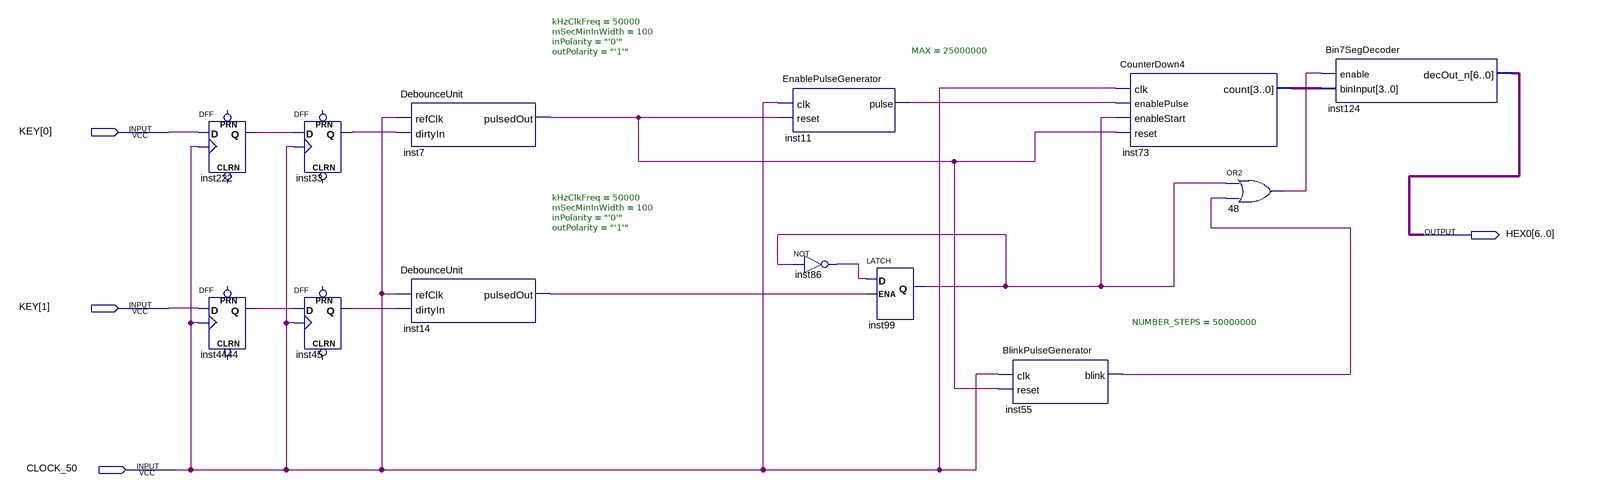
[diagram p0: schematic sheet]
// Quartus schematic Fase6.bdf as structural Verilog: 13 symbols, 4 pins
module Fase6 (
  input  [1:0] KEY,
  input  CLOCK_50,
  output [6:0] HEX0
);

  wire inst7_pulsedout, inst11_pulse, inst14_pulsedout, inst33_q, inst45_q, inst55_blink, inst86_out,
       inst99_q, inst222_q, inst4444_q, n48_out;
  wire [3:0] inst73_count;

  DFF inst222 (.CLK(CLOCK_50), .D(KEY[0]), .Q(inst222_q));  // open: CLRN, PRN
  DFF inst4444 (.CLK(CLOCK_50), .D(KEY[1]), .Q(inst4444_q));  // open: CLRN, PRN
  DFF inst33 (.CLK(CLOCK_50), .D(inst222_q), .Q(inst33_q));  // open: CLRN, PRN
  DFF inst45 (.CLK(CLOCK_50), .D(inst4444_q), .Q(inst45_q));  // open: CLRN, PRN
  DebounceUnit #(.kHzClkFreq(50000), .mSecMinInWidth(100), .inPolarity("'0'"), .outPolarity("'1'")) inst7 (
    .refClk(CLOCK_50), .dirtyIn(inst33_q), .pulsedOut(inst7_pulsedout));
  DebounceUnit #(.kHzClkFreq(50000), .mSecMinInWidth(100), .inPolarity("'0'"), .outPolarity("'1'")) inst14 (
    .refClk(CLOCK_50), .dirtyIn(inst45_q), .pulsedOut(inst14_pulsedout));
  EnablePulseGenerator #(.MAX(25000000)) inst11 (.clk(CLOCK_50), .reset(inst7_pulsedout), .pulse(inst11_pulse));
  not inst86 (inst86_out, inst99_q);
  LATCH inst99 (.D(inst86_out), .ENA(inst14_pulsedout), .Q(inst99_q));
  BlinkPulseGenerator #(.NUMBER_STEPS(50000000)) inst55 (.clk(CLOCK_50), .reset(inst7_pulsedout), .blink(inst55_blink));
  CounterDown4 inst73 (
    .clk(CLOCK_50), .enablePulse(inst11_pulse), .enableStart(inst99_q), .reset(inst7_pulsedout),
    .count(inst73_count));
  or u_48 (n48_out, inst99_q, inst55_blink);
  Bin7SegDecoder inst124 (.enable(n48_out), .binInput(inst73_count), .decOut_n(HEX0));
endmodule
